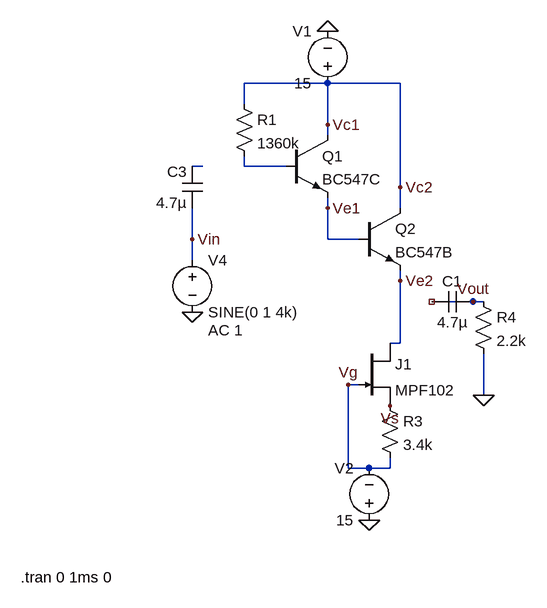
[diagram p0: schematic Darlington.asc]
Darlington.asc, the LTspice schematic file:
Version 4
SHEET 1 880 808
WIRE 176 32 48 32
WIRE 288 32 176 32
WIRE 48 64 48 32
WIRE 176 96 176 32
WIRE 176 112 176 96
WIRE -16 160 -32 160
WIRE 48 160 48 144
WIRE 112 160 48 160
WIRE 288 192 288 32
WIRE 176 224 176 208
WIRE 288 224 288 192
WIRE -32 272 -32 224
WIRE 176 272 176 224
WIRE 224 272 176 272
WIRE -32 304 -32 272
WIRE 288 336 288 320
WIRE 400 368 352 368
WIRE 416 368 400 368
WIRE 288 432 288 336
WIRE 288 432 272 432
WIRE 224 496 208 496
WIRE 416 512 416 448
WIRE 208 624 208 496
WIRE 240 624 208 624
WIRE 272 624 272 608
WIRE 272 624 240 624
FLAG 240 704 0
FLAG 176 -48 0
FLAG 416 512 0
FLAG -32 384 0
FLAG 400 368 Vout
FLAG -32 272 Vin
FLAG 208 496 Vg
FLAG 272 528 Vs
FLAG 176 96 Vc1
FLAG 288 192 Vc2
FLAG 176 224 Ve1
FLAG 288 336 Ve2
SYMBOL npn 112 112 R0
SYMATTR InstName Q1
SYMATTR Value BC547C
SYMBOL npn 224 224 R0
SYMATTR InstName Q2
SYMATTR Value BC547B
SYMBOL res 32 48 R0
SYMATTR InstName R1
SYMATTR Value 1360k
SYMBOL res 256 512 R0
SYMATTR InstName R3
SYMATTR Value 3.4k
SYMBOL voltage 176 48 R180
WINDOW 0 24 96 Left 2
WINDOW 3 24 16 Left 2
WINDOW 123 0 0 Left 0
WINDOW 39 0 0 Left 0
SYMATTR InstName V1
SYMATTR Value 15
SYMBOL voltage 240 720 R180
WINDOW 0 24 96 Left 2
WINDOW 3 24 16 Left 2
WINDOW 123 0 0 Left 0
WINDOW 39 0 0 Left 0
SYMATTR InstName V2
SYMATTR Value 15
SYMBOL res 400 352 R0
SYMATTR InstName R4
SYMATTR Value 2.2k
SYMBOL voltage -32 288 R0
WINDOW 123 24 124 Left 2
WINDOW 39 0 0 Left 0
SYMATTR Value2 AC 1
SYMATTR InstName V4
SYMATTR Value SINE(0 1 4k)
SYMBOL njf 224 432 R0
SYMATTR InstName J1
SYMATTR Value MPF102
SYMBOL cap -16 224 R180
WINDOW 0 24 56 Left 2
WINDOW 3 24 8 Left 2
SYMATTR InstName C3
SYMATTR Value 4.7µ
SYMBOL cap 400 352 R90
WINDOW 0 0 32 VBottom 2
WINDOW 3 32 32 VTop 2
SYMATTR InstName C1
SYMATTR Value 4.7µ
TEXT -296 792 Left 2 !.tran 0 1ms 0

The netlist it stands for:
* Darlington.asc
Q1 Vc2 N002 Ve1 0 BC547C
Q2 Vc2 Ve1 Ve2 0 BC547B
R1 Vc2 N002 1360k
R3 Vs Vg 3.4k
V1 Vc2 0 15
V2 0 Vg 15
R4 Vout 0 2.2k
V4 Vin 0 SINE(0 1 4k) AC 1
J1 Ve2 Vg Vs MPF102
C3 Vin N001 4.7µ
C1 Vout NC_01 4.7µ
.model NPN NPN
.model PNP PNP
.lib standard.bjt
.model NJF NJF
.model PJF PJF
.lib standard.jft
.tran 0 1ms 0
.backanno
.end